# EAGLE design HybrideNixieClock (EAGLE 9.5.2)
COMPANY: ADAFRUIT INDUSTRIES; DRAWN: KTOWN; REV: B
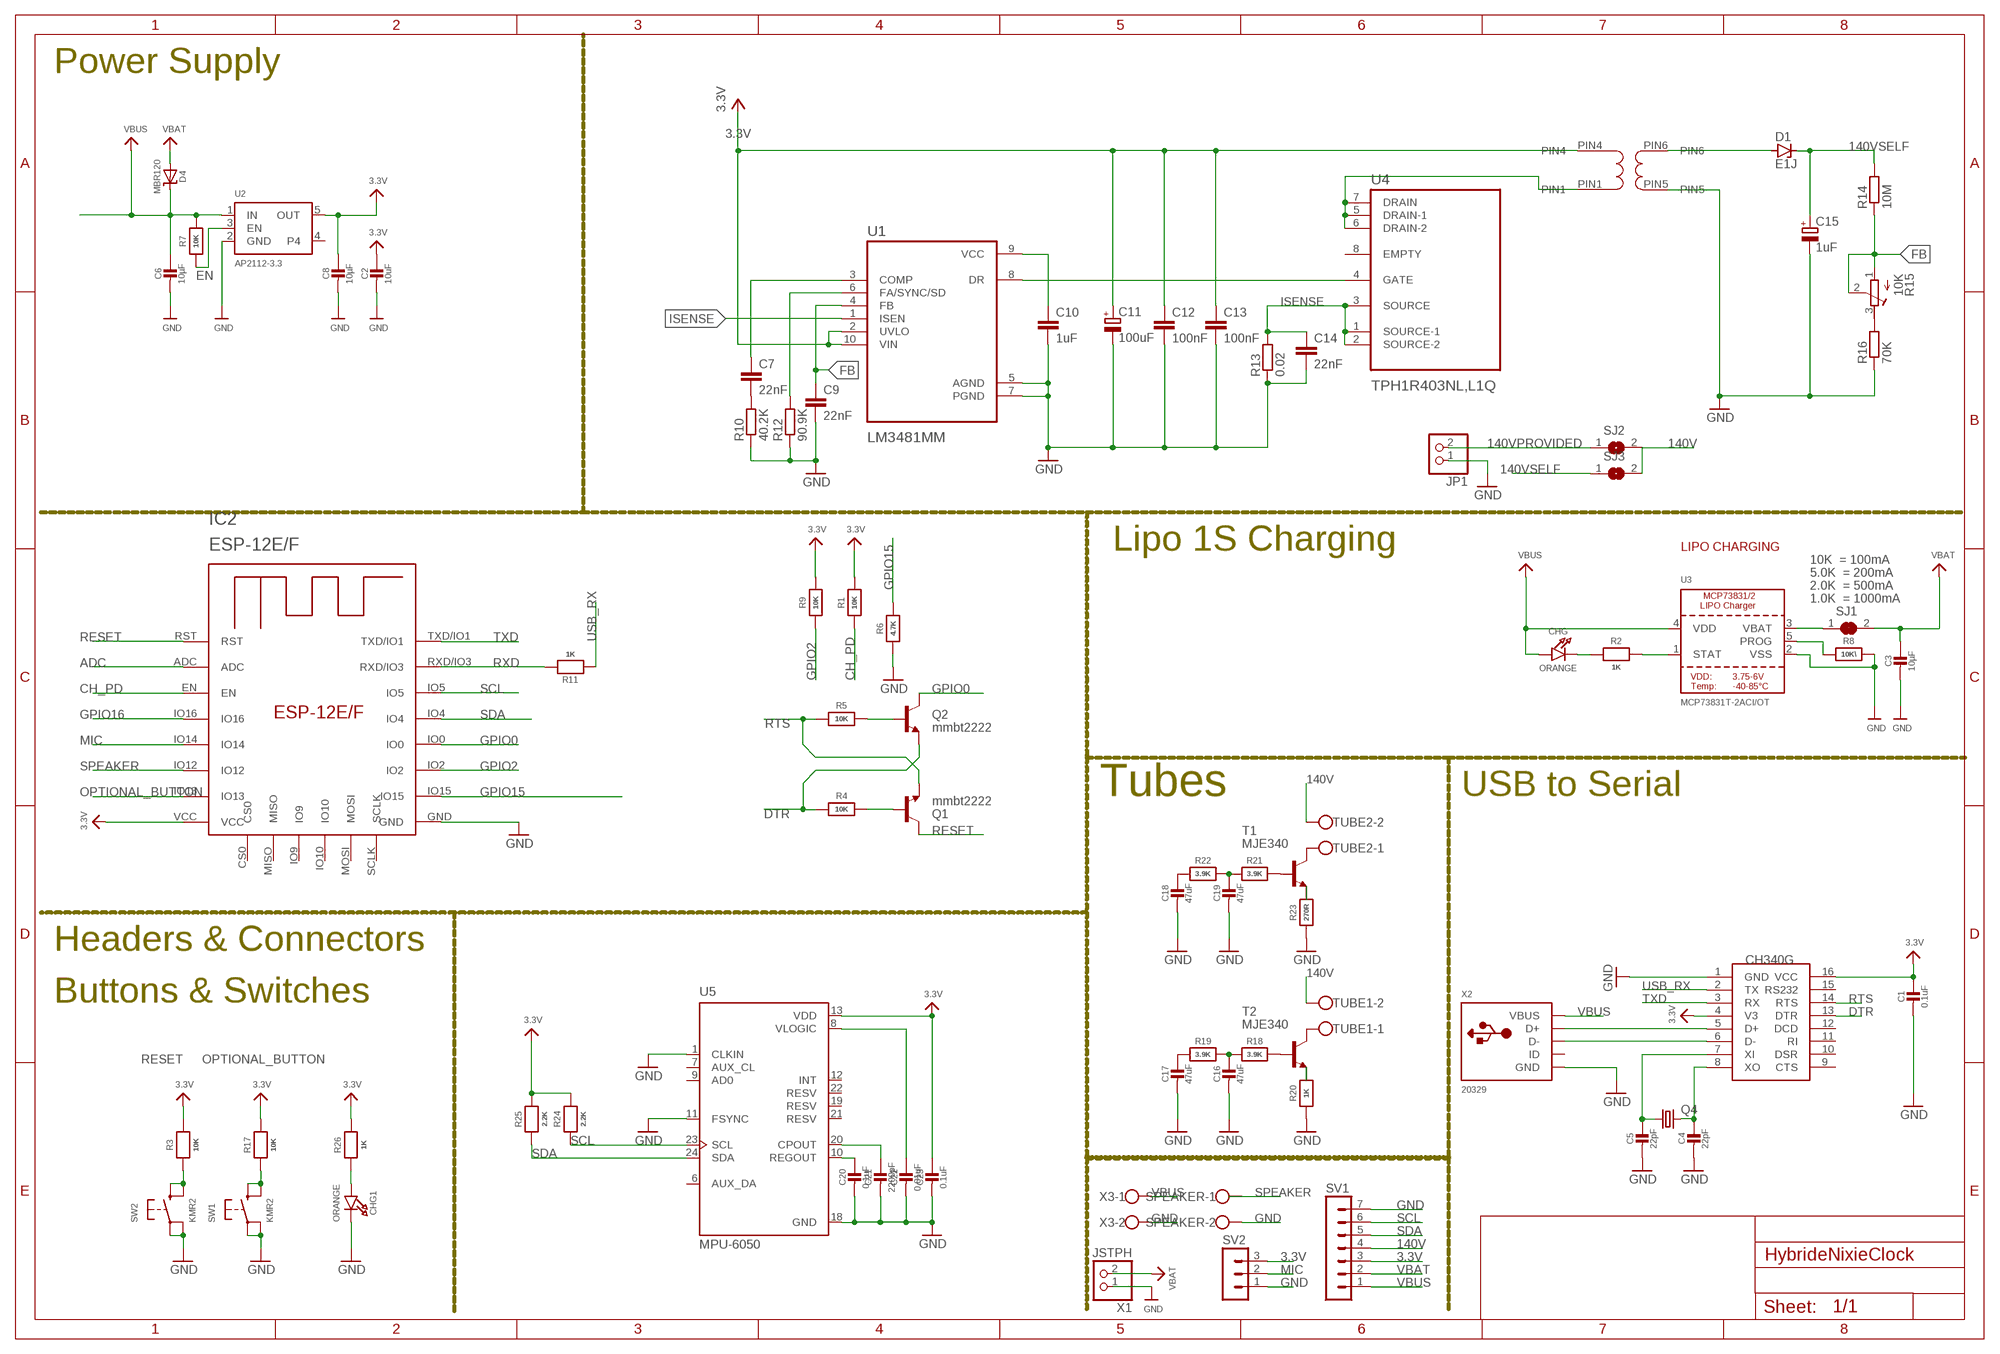
[diagram p0: schematic, sheet 1]

## Parts
C1  0.1uF  CAP_CERAMIC0603_NO  [0603-NO]
C2  10uF  CAP_CERAMIC0805-NOOUTLINE  [0805-NO]
C3  10µF  CAP_CERAMIC0805-NOOUTLINE  [0805-NO]
C4  22pF  CAP_CERAMIC0603_NO  [0603-NO]
C5  22pF  CAP_CERAMIC0603_NO  [0603-NO]
C6  10µF  CAP_CERAMIC0805-NOOUTLINE  [0805-NO]
C7  22nF  C-EUC0603  [C0603]
C8  10µF  CAP_CERAMIC0805-NOOUTLINE  [0805-NO]
C9  22nF  C-EUC0603  [C0603]
C10  1uF  C-EUC0603  [C0603]
C11  100uF  CPOL-EUCT3216  [CT3216]
C12  100nF  C-EUC0603  [C0603]
C13  100nF  C-EUC0603  [C0603]
C14  22nF  C-EUC0603  [C0603]
C15  1uF  CPOL-EUCT3216  [CT3216]
C16  47uF  CAP_CERAMIC0603_NO  [0603-NO]
C17  47uF  CAP_CERAMIC0603_NO  [0603-NO]
C18  47uF  CAP_CERAMIC0603_NO  [0603-NO]
C19  47uF  CAP_CERAMIC0603_NO  [0603-NO]
C20  0.1uF  CAP_CERAMIC0603_NO  [0603-NO]
C21  2200pF  CAP_CERAMIC0603_NO  [0603-NO]
C22  0.01uF  CAP_CERAMIC0603_NO  [0603-NO]
C23  0.1uF  CAP_CERAMIC0603_NO  [0603-NO]
CHG  ORANGE  LED0805_NOOUTLINE  [CHIPLED_0805_NOOUTLINE]
CHG1  ORANGE  LED0805_NOOUTLINE  [CHIPLED_0805_NOOUTLINE]
D1  E1J  ZENER-DIODESMB  [SMB]
D4  MBR120  DIODE-SCHOTTKYSOD-123  [SOD-123]
IC2  ESP-12E/F  [ESP-12E]
JP1  PINHD-1X2  [1X02]
Q1  mmbt2222  TRANSISTOR_NPNSOT23-3  [SOT23-3]
Q2  mmbt2222  TRANSISTOR_NPNSOT23-3  [SOT23-3]
Q4  CRYSTALCTS406  [CTS406]
R1  10K  RESISTOR_0603_NOOUT  [0603-NO]
R2  1K  RESISTOR_0603_NOOUT  [0603-NO]
R3  10K  RESISTOR_0603_NOOUT  [0603-NO]
R4  10K  RESISTOR_0603_NOOUT  [0603-NO]
R5  10K  RESISTOR_0603_NOOUT  [0603-NO]
R6  4.7K  RESISTOR_0603_NOOUT  [0603-NO]
R7  10K  RESISTOR_0603_NOOUT  [0603-NO]
R8  10K\  RESISTOR_0603_NOOUT  [0603-NO]
R9  10K  RESISTOR_0603_NOOUT  [0603-NO]
R10  40.2K  R-EU_R0603  [R0603]
R11  1K  RESISTOR_0603MP  [_0603MP]
R12  90.9K  R-EU_R0603  [R0603]
R13  0.02  R-EU_R0603  [R0603]
R14  10M  R-EU_R0603  [R0603]
R15  10K  R-TRIMM4G/J  [RTRIM4G/J]
R16  70K  R-EU_R0603  [R0603]
R17  10K  RESISTOR_0603_NOOUT  [0603-NO]
R18  3.9K  RESISTOR_0603_NOOUT  [0603-NO]
R19  3.9K  RESISTOR_0603_NOOUT  [0603-NO]
R20  1K  RESISTOR_0603_NOOUT  [0603-NO]
R21  3.9K  RESISTOR_0603_NOOUT  [0603-NO]
R22  3.9K  RESISTOR_0603_NOOUT  [0603-NO]
R23  270R  RESISTOR_0603_NOOUT  [0603-NO]
R24  2.2K  RESISTOR_0603_NOOUT  [0603-NO]
R25  2.2K  RESISTOR_0603_NOOUT  [0603-NO]
R26  1K  RESISTOR_0603_NOOUT  [0603-NO]
SJ1  SOLDERJUMPER_CLOSED  [SOLDERJUMPER_CLOSEDWIRE]
SJ2  SJ  [SJ]
SJ3  SJ  [SJ]
SPEAKER  W237-102  [W237-102]
SV1  MA07-1  [MA07-1]
SV2  MA03-1  [MA03-1]
SW1  KMR2  SWITCH_TACT_SMT4.6X2.8  [BTN_KMR2_4.6X2.8]
SW2  KMR2  SWITCH_TACT_SMT4.6X2.8  [BTN_KMR2_4.6X2.8]
T1  MJE340  [TO126]
T2  MJE340  [TO126]
TUBE1  W237-102  [W237-102]
TUBE2  W237-102  [W237-102]
U1  LM3481MM  [SOP50P490X110-10N]
U2  AP2112-3.3  VREG_SOT23-5  [SOT23-5]
U3  MCP73831T-2ACI/OT  MCP73831/2  [SOT23-5]
U4  TPH1R403NL,L1Q  [TRANS_TPHR8504PL,L1Q]
U5  MPU-6050  [QFN50P400X400X95-24N]
U$6  TTRN-060S-013  [TTRN-060S-013]
U$7  CH340G  [SOIC16]
X1  JSTPH  CON_JST_PH_2PIN  [JSTPH2]
X2  20329  USB_MICRO_20329_V2  [4UCONN_20329_V2]
X3  W237-102  [W237-102]

## Nets
3.3V: C1.1 C2.1 C8.1 C11.+ C12.1 C13.1 C23.1 IC2.VCC R1.2 R3.2 R9.2 R17.2 R24.2 R25.2 R26.2 SV1.3 SV2.3 U1.2(UVLO) U1.10(VIN) U2.5(OUT) U5.13(VDD) U$6.PIN4 U$7.4(V3) U$7.16(VCC)
140V: SJ2.2 SJ3.2 SV1.4 TUBE1.2 TUBE2.2
140VPROVIDED: JP1.2 SJ2.1
140VSELF: C15.+ D1.C R14.2 SJ3.1
ADC: IC2.ADC
CH_PD: IC2.EN R1.1
DTR: Q2.2(E) R4.1 U$7.13(DTR)
EN: R7.1 U2.3(EN)
FB: C9.1 R14.1 R15.1(A) R15.2(S) U1.4(FB)
GND: C1.2 C2.2 C3.2 C4.2 C5.2 C6.2 C8.2 C9.2 C10.2 C11.- C12.2 C13.2 C14.2 C15.- C16.2 C17.2 C18.2 C19.2 C20.2 C21.2 C22.2 C23.2 CHG1.C IC2.GND JP1.1 R6.1 R8.2 R10.1 R12.1 R13.1 R16.1 R20.1 R23.1 SPEAKER.2 SV1.7 SV2.1 SW1.A'(P1) SW1.A(P) SW2.A'(P1) SW2.A(P) U1.5(AGND) U1.7(PGND) U2.2(GND) U3.2(VSS) U5.1(CLKIN) U5.11(FSYNC) U5.18(GND) U$6.PIN5 U$7.1(GND) X1.1 X2.BASE@1(GND) X2.BASE@2(GND) X2.GND X2.SPRT@1(GND) X2.SPRT@2(GND) X2.SPRT@3(GND) X2.SPRT@4(GND) X3.2
GPIO0: IC2.IO0 Q2.3(C)
GPIO2: IC2.IO2 R9.1
GPIO15: IC2.IO15 R6.2
GPIO16: IC2.IO16
ISENSE: C14.1 R13.2 U1.1(ISEN) U4.1(SOURCE-1) U4.2(SOURCE-2) U4.3(SOURCE)
MIC: IC2.IO14 SV2.2
N$1: CHG.C R2.1
N$2: C7.2 R10.2
N$3: R2.2 U3.1(STAT)
N$4: R8.1 U3.5(PROG)
N$5: C7.1 U1.3(COMP)
N$6: U4.5(DRAIN-1) U4.6(DRAIN-2) U4.7(DRAIN) U$6.PIN1
N$7: SJ1.1 U3.3(VBAT)
N$8: R18.2 T2.3(B)
N$9: U$7.6(D-) X2.D-
N$10: U$7.5(D+) X2.D+
N$11: D1.A U1.8(DR) U4.4(GATE) U$6.PIN6
N$12: Q1.1(B) R4.2
N$13: Q2.1(B) R5.2
N$14: C5.1 Q4.1 U$7.7(XI)
N$15: C4.1 Q4.3 U$7.8(XO)
N$16: C10.1 U1.9(VCC)
N$17: R12.2 U1.6(FA/SYNC/SD)
N$18: R23.2 T1.1(E)
N$19: R15.3(E) R16.2
N$20: C16.1 R18.1 R19.2
N$21: C17.1 R19.1
N$22: R21.2 T1.3(B)
N$23: C19.1 R21.1 R22.2
N$24: C18.1 R22.1
N$25: T2.2(C) TUBE1.1
N$26: T1.2(C) TUBE2.1
N$27: R20.2 T2.1(E)
N$28: C20.1 U5.10(REGOUT)
N$29: C21.1 U5.20(CPOUT)
N$30: CHG1.A R26.1
N$31: C22.1 U5.8(VLOGIC)
OPTIONAL_BUTTON: IC2.IO13 R17.1 SW1.B'(S1) SW1.B(S)
RESET: IC2.RST Q1.3(C) R3.1 SW2.B'(S1) SW2.B(S)
RTS: Q1.2(E) R5.1 U$7.14(RTS)
RXD: IC2.RXD/IO3 R11.2
SCL: IC2.IO5 R24.1 SV1.6 U5.23(SCL)
SDA: IC2.IO4 R25.1 SV1.5 U5.24(SDA)
SPEAKER: IC2.IO12 SPEAKER.1
TXD: IC2.TXD/IO1 U$7.3(RX)
USB_RX: R11.1 U$7.2(TX)
VBAT: C3.1 D4.A SJ1.2 SV1.2 X1.2
VBUS: C6.1 CHG.A D4.C R7.2 SV1.1 U2.1(IN) U3.4(VDD) X2.VBUS X3.1
Unconnected: IC2.CS0 IC2.IO9 IC2.IO10 IC2.MISO IC2.MOSI IC2.SCLK U2.4 U4.8(EMPTY) U5.6(AUX_DA) U5.7(AUX_CL) U5.9(AD0) U5.12(INT) U5.19(RESV) U5.21(RESV) U5.22(RESV) U$7.9(CTS) U$7.10(DSR) U$7.11(RI) U$7.12(DCD) U$7.15(RS232) X2.ID

## Notes on the sheet
- Power Supply
- Lipo 1S Charging | LIPO CHARGING
- 10K  = 100mA
- 5.0K  = 200mA
- 2.0K  = 500mA
- 1.0K  = 1000mA
- Tubes | USB to Serial
- Headers & Connectors
- Buttons & Switches

## Library data of the parts
C1-C6 C8 C16-C23 = microbuilder:CAP_CERAMIC: Ceramic Capacitors For new designs, use the packages preceded by an '_' character since they are more reliable: The following footprints should be used on most boards: _0402 - Standard footprint for regular board layouts _0603 - Standard footprint for regular board layouts _0805 - Standard footprint for regular board layouts _1206 - Standard footprint for regular board layouts For extremely tight-pitch boards where space is at a premium, the following 'micro-pitch' footprints can be used (smaller pads, no silkscreen outline, etc.): _0402MP - Micro-pitch footprint for very dense/compact boards _0603MP - Micro-pitch footprint for very dense/compact boards _0805MP - Micro-pitch footprint for very dense/compact boards _1206MP - Micro-pitch footprint for very dense/compact boards
C7 C9 C10 C12-C14 = rcl:C-EU: CAPACITOR, European symbol; SPICEPREFIX: C
C11 C15 = rcl:CPOL-EU: POLARIZED CAPACITOR, European symbol; SPICEPREFIX: C
CHG CHG1 = microbuilder:LED: LED 0603 - 0603 Surface Mount Package 2mA: Green LED - Low Power (3.9mcd, 2ma, 1.7Vf) - Digikey: 475-2709-2-ND Orange LED - Low Power (9.8mcd, 2ma, 1.8Vf) - Digikey: 475-1194-2-ND Red LED - Low Power (5mcd, 2ma, 1.8Vf) - Digikey: 475-1195-2-ND Yellow LED - Low Power (7mcd, 2ma, 1.8Vf) - Digikey: 475-1196-2-ND 5mA: Blue LED - Low Power (17mcd, 5ma, 2.9Vf) - Digikey: LNJ937W8CRACT-ND 0805 - 0805 Surface Mount Package 2mA: Red LED (8.8mcd, 2mA, 1.8Vf, Clear) - Low Power [Digikey: 475-2510-1-ND] Green LED (5mcd, 2mA, 1.8Vf, Clear) - Low Power [Digikey: 475-2730-1-ND] Yellow LED (11.3mcd, 2mA, 1.8Vf, Clear) - Low Power [Digikey: 475-2555-1-ND] 20mA: Red LED (104mcd, 20mA, Diffused) - LS R976 [Digikey: 475-1278-6-ND] Red LED (12mcd, 20mA, 2.0Vf, Clear) - APT2012EC [Digikey: 754-1128-1-ND] Green LED (15mcd, 20mA, 2.2Vf, Clear) - APT2012GC [Digikey: 754-1131-1-ND] Orange LED (160mcd, 20mA, 2.1Vf, Clear) - APT2012SECK [Digikey: 754-1130-1-ND] 1206 - 1206 Surface Mount Package Green LED (26mcd, 20mA, Diffused) - LG N971 [Digikey: 475-1407-6-ND] Red LED (15mcd, 20mA, Diffused) - LH N974 [Digikey: 475-1416-6-ND] Cree - Cree High-Power Surface Mount LEDs XPEBWT-L1-0000-00D50 - White 111lm 350mA 2.9Vf 6200K 110° XTEAWT-00-0000-00000LEE3 - White 114lm 350mA 2.85Vf 5000K 115° Everlight - Everlight 45-21 Series Surface Mount LEDs 45-21/QK2C-B2832AC2CB2/2T - Warm White 2000mcd 20mA 3.25Vf 3050K 120° 45-21/LK2C-B38452C4CB2/2T - Nuetral White 2000mcd 20mA 3.25Vf 4150K 120° 45-21/LK2C-B50634C6CB2/2T - Cold White 2200mcd 20mA 3.25Vf 5650K 120° PLCC2 Reverse Mount LS T77K-J1L2-1-0-2-R18-Z - Red 11.25mcd 2mA 1.8Vf 630nm 120° LO T77K-L1M2-24-Z - Orange 19.6mcd 2mA 1.8Vf 606nm 120° LY T77K-K2M1-26-Z - Yellow 15.7mcd 2mA 1.8Vf 587nm 120°
D1 = diode:ZENER-DIODE: Z-Diode
D4 = microbuilder:DIODE-SCHOTTKY
IC2 = esp-12e-f:ESP-12E/F
JP1 = pinhead:PINHD-1X2: PIN HEADER
Q1 Q2 = SparkFun:TRANSISTOR_NPN: Transistor NPN BJT configuration in SOT23 package. MMBT2222 is the common NPN we use. Double check BCE configuration again layout.
Q4 = crystal:CRYSTAL: CRYSTAL; OC_FARNELL: unknown; OC_NEWARK: unknown
R1-R9 R11 R17-R26 = microbuilder:RESISTOR: Resistors For new designs, use the packages preceded by an '_' character since they are more reliable: The following footprints should be used on most boards: _0402 - Standard footprint for regular board layouts _0603 - Standard footprint for regular board layouts _0805 - Standard footprint for regular board layouts _1206 - Standard footprint for regular board layouts For extremely tight-pitch boards where space is at a premium, the following 'micro-pitch' footprints can be used (smaller pads, no silkscreen outline, etc.): _0402MP - Micro-pitch footprint for very dense/compact boards _0603MP - Micro-pitch footprint for very dense/compact boards _0805MP - Micro-pitch footprint for very dense/compact boards _1206MP - Micro-pitch footprint for very dense/compact boards
R10 R12-R14 R16 = rcl:R-EU_: RESISTOR, European symbol; SPICEPREFIX: R
R15 = rcl:R-TRIMM: Trimm resistor; SPICEMODEL: X; SPICEPREFIXL: POT
SJ1 = microbuilder:SOLDERJUMPER_CLOSED: Solder Jumper - Closed These solder jumpers are closed by default CLOSEDWIRE - 10 mil trace between pads that can be cut and resoldered later CLOSEDPERM - 63 mil trace between pads for a permanent connection (used to 'bridge' two signals, a shameless hack for Eagle). Can double as a test point as well (no cream layer)
SJ2 SJ3 = jumper:SJ: SMD solder JUMPER
SPEAKER TUBE1 TUBE2 X3 = con-wago-500:W237-102: WAGO SCREW CLAMP; MPN: 237-102; OC_FARNELL: unknown; OC_NEWARK: 70K9898
SV1 = con-lstb:MA07-1: PIN HEADER; OC_FARNELL: unknown; OC_NEWARK: unknown
SV2 = con-lstb:MA03-1: PIN HEADER; OC_FARNELL: unknown; OC_NEWARK: unknown
SW1 SW2 = microbuilder:SWITCH_TACT_SMT: SMT Tact Switches 6x6mm - Digikey: P12940SCT-ND KMR2 (4.6x2.8mm) - Digikey: 401-1426-1-ND EVQ-PQHB55 - Light Touch, 160GF (4.5x4.5mm) - Digikey: P8090SCT-ND KMT0 - KMT021 NGJ LHS (etc.) IP68/Waterproof - Digikey: CKN10289CT-ND
T1 T2 = MJE340:MJE340: NPN TRANSISTOR Check prices <https://pricing.snapeda.com/search/part/MJE340/?ref=eda>; AVAILABILITY: Good; DESCRIPTION: Bipolar (BJT) Transistor NPN 300V 500mA 20.8W Through Hole SOT-32-3; MF: STMicroelectronics; MP: MJE340; PACKAGE: TO-126-3 Motorola; PRICE: None; PURCHASE-URL: https://pricing.snapeda.com/search/part/MJE340/?ref=eda
U1 = LM3481MM:LM3481MM: Check prices <https://snapeda.com/parts/LM3481MM/NOPB/Texas%20Instruments/view-part/?ref=eda>; ARROW_ASIA-PURCHASE-URL: https://snapeda.com/shop?store=Arrow+Asia&id=15397; ARROW_ELECTRONICS-PURCHASE-URL: https://snapeda.com/shop?store=Arrow+Electronics&id=15397; AVAILABILITY: Good; DESCRIPTION: 2.97V to 48V High-Efficiency Controller for Boost, SEPIC and Flyback 10-VSSOP -40 to 125; DIGIKEY-PURCHASE-URL: https://snapeda.com/shop?store=DigiKey&id=15397; MF: Texas Instruments; MOUSER-PURCHASE-URL: https://snapeda.com/shop?store=Mouser&id=15397; MP: LM3481MM/NOPB; PACKAGE: VSSOP-10 Texas Instruments; PRICE: None; TEXAS_INSTRUMENTS-PURCHASE-URL: https://snapeda.com/shop?store=Texas+Instruments&id=15397
U2 = microbuilder:VREG_SOT23-5: SOT23-5 Fixed Voltage Regulators Part Current Out V Out V In V Dropout θJA (°C/W) TJ (°C) Digikey Part No. ADP121 150mA 3.3V 3.4-5.5V 0.09V @ 150mA -- -- ADP121-AUJZ33R7CT-ND ADP121 150mA 3.0V 3.1-5.5V 0.09V @ 150mA -- -- ADP121-AUJZ30R7CT-ND ADP122 300mA 3.3V 3.4-5.5V 0.085V @ 300mA -- -- ADP122AUJZ-3.3-R7CT-ND ADP1712 300mA 3.3V 3.5-5.5V 0.17V @ 300mA -- -- ADP1712AUJZ-3.3-R7TR-ND AP7311 (Low Cost) 150mA 3.3V 3.5-6V 0.15V @ 150mA -- -- AP7311-33WG-7DICT-ND LD39015M18R 150mA 1.8V 1.9V-5.5V 0.08V @ 100mA -- -- 497-6977-1-ND LP2985A-33DBVR 150mA 3.3V 3.3-16V 0.28V @ 150mA 206 150 296-18479-1-ND MCP1824T-3302E/OT 300mA 3.3V 3.5V-6V 0.2V @ 300mA -- -- MCP1824T-3302E/OTCT-ND MIC5205-2.5YM5 TR 150mA 2.5V 2.7-16V 0.165V @ 150mA -- -- 576-1257-2-ND MIC5205-3.0YM5 TR 150mA 3.0V 3.2V-16V 0.165V @ 150mA -- -- 576-1258-2-ND MIC5205-3.3YM5 TR 150mA 3.3V 3.5V-16V 0.165V @ 150mA -- -- 576-1259-2-ND TPS780330220 150mA 3.3V+2.2V 3.6-5.5V 250mV Max -- -- 296-23332-1-ND TDA3663/N1,135 100mA 3.3V 3.5-45V 0.18V @ 50mA -- -- 568-5343-1-ND Max operating temp can be calculated using θJA, TJ (max junction temperature), and power in watts. Set the "Maximum Ambient Temperature" until it reaches TJ ("Max Junction Temperature"), which is the absolute limit for safe use of the regulator: Heat Sink Temperature Calculator <http://www.daycounter.com/Calculators/Heat-Sink-Temperature-Calculator.phtml> For example, With 12V source into a 3.3V LP2985 and a 30mA load, we are dissipating (12V-3.3V) * 0.03A = 0.261W. With a θJA of 206 °C/W, a TJ of 150°C, and 261mW we can safely use the chip without a heat sink up to 75°C (=147.1°C Junction Temperature).
U3 = microbuilder:MCP73831/2: MCP73831/2 LIPO Charger VDD: 3.75 - 6V Temp -40 - 85°C Programmable Charge Rate: 15-500mA NOTE: STAT is a tri-state logic output on the MCP73831 and an open-drain output on the MCP73832. SOT23-5 with 4.2V output and tri-state logic on STAT = MCP73831T-2ACI/OT
U4 = TPH1R403NL_L1Q:TPH1R403NL,L1Q: None Check prices <https://snapeda.com/parts/TPH1R403NL%2CL1Q/Toshiba%20Semiconductor/view-part/?ref=eda>; AVAILABILITY: Warning; DESCRIPTION: N-Channel 30V 60A (Ta) 1.6W (Ta), 64W (Tc) Surface Mount 8-SOP Advance (5x5); MF: Toshiba Semiconductor; MOUSER-PURCHASE-URL: https://snapeda.com/shop?store=Mouser&id=739373; MP: TPH1R403NL,L1Q; PACKAGE: SOP-8 Toshiba; PRICE: None
U5 = MPU-6050:MPU-6050: MPU-6050 Six-Axis (Gyro + Accelerometer) MEMS MotionTracking™ Devices Check prices <https://pricing.snapeda.com/search/part/MPU-6050/?ref=eda>; AVAILABILITY: Warning; DESCRIPTION: Accelerometer, Gyroscope, 6 Axis Sensor I²C Output; MF: TDK InvenSense; MP: MPU-6050; PACKAGE: VFQFN-24 TDK InvenSense; PRICE: None; PURCHASE-URL: https://pricing.snapeda.com/search/part/MPU-6050/?ref=eda
U$6 = Nixie Coil V2:TTRN-060S-013
U$7 = ch340g:CH340G
X1 = microbuilder:CON_JST_PH_2PIN: JST 2-Pin Right-Angle Connector PH-Series - 4UConnector: 17311 SH-Series - 4UConnector: 07278
X2 = microbuilder:USB: USB Connectors USBMINIB - Surface Mount Female Mini-B USB Connector 4UConnector: 06564

## Board
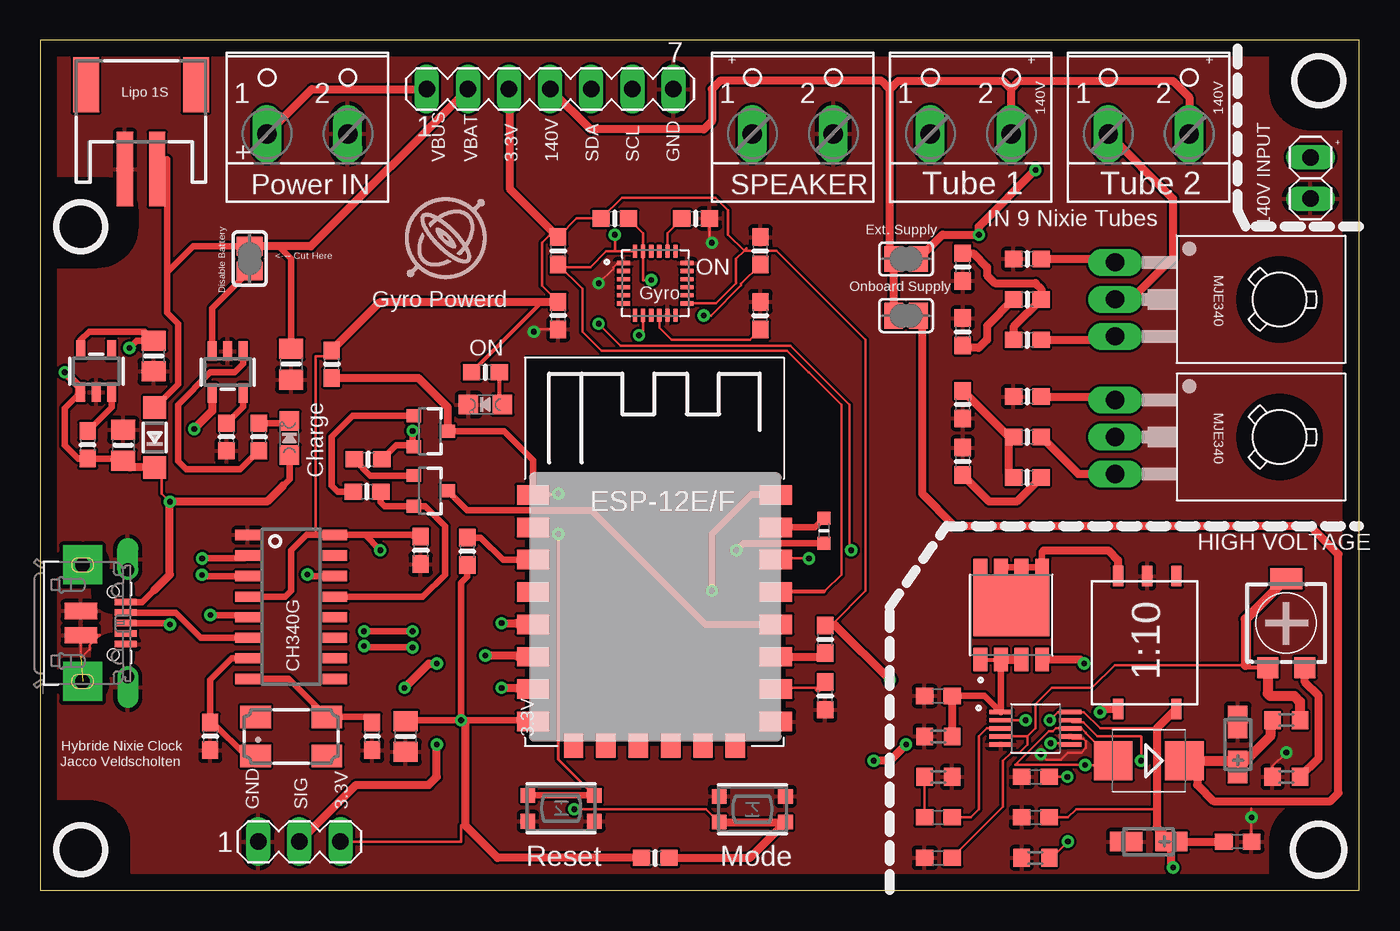
[diagram p1: board, top side]
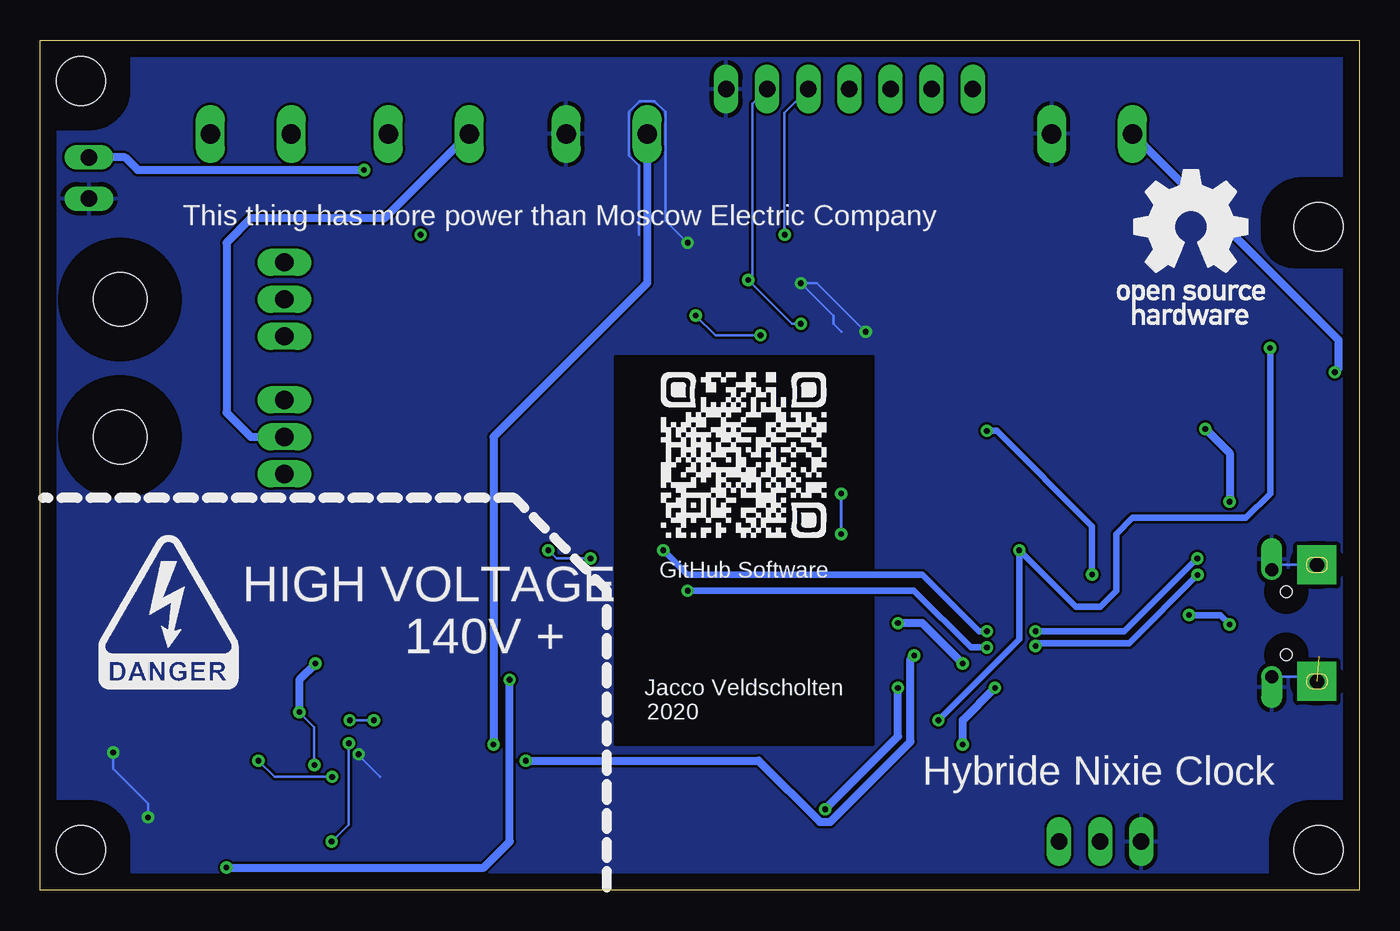
[diagram p2: board, bottom side, seen from below]

Size 81.5 x 52.5 mm. Coordinates in mm from the lower left corner, seen from the top.
Outline: 0,0 81.5,0 81.5,52.5 0,52.5 0,0
Copper layers (1*16): Top 0.035mm / dielectric 1.5mm / Bottom 0.035mm
Design rules "default *": minimum track width 6mil, minimum drill 0.35mm, track to track 6mil, track to pad 6mil, pad to pad 6mil, via to via 6mil, smd to smd 6mil, copper to edge 40mil, drill to drill 6mil, minimum pad ring 10mil, minimum via ring 8mil, stop-mask expansion 4mil, vias tented up to drill 20mil, thermal gap 10mil
Holes 3 mm at 2.5,2.5 79,50 79,2.5 2.5,41
tRestrict: area 30,9 to 46,33; area 0,0 to 5.5,5.5; area 76,0 to 81.5,5.5; area 0,38.5 to 6,44; area 76,47 to 81.5,52.5
bRestrict: area 30,9 to 46,33; area 76,0 to 81.5,5.5; area 76,47 to 81.5,52.5; area 0,0 to 5.5,5.5; area 0,38.5 to 6,44

### Footprints (pad centres in the part's own frame; a part is rotated, then mirrored left to right if it is on the bottom)
0603-NO = smd 1.075 x 1: 1 -0.85,0; 2 0.85,0
0805-NO = smd 1.24 x 1.5: 1 -0.95,0; 2 0.95,0
C0603 = smd 1.1 x 1: 1 -0.85,0; 2 0.85,0
CT3216 = smd 2 x 1.2: + -1.4,0; - 1.4,0
CHIPLED_0805_NOOUTLINE = smd 1.2 x 1.2: A 0,-1.05; C 0,1.05
SMB = smd 2.4 x 2.4: A 2.2,0; C -2.2,0
SOD-123 = smd 1.4 x 1.4: A 1.85,0; C -1.85,0
ESP-12E = smd 2 x 1.2: ADC -7.46,5.53; EN -7.46,3.53; GND 7.54,-6.47; IO0 7.54,-0.47; IO2 7.54,-2.47; IO4 7.54,1.53; IO5 7.54,3.53; IO12 -7.46,-2.47; IO13 -7.46,-4.47; IO14 -7.46,-0.47; IO15 7.54,-4.47; IO16 -7.46,1.53; RST -7.46,7.53; RXD/IO3 7.54,5.53; TXD/IO1 7.54,7.53; VCC -7.46,-6.47 | smd 1.2 x 1.5: CS0 -4.96,-7.97; IO9 -0.96,-7.97; IO10 1.04,-7.97; MISO -2.96,-7.97; MOSI 3.04,-7.97; SCLK 5.04,-7.97
1X02 = drill 1.016 long: 1 -1.27,0; 2 1.27,0
SOT23-3 = smd 0.8 x 0.9: 1 -0.95,-1; 2 0.95,-1; 3 0,1.1
CTS406 = smd 1.9 x 1.4: 1 -2.2,-1.2; 2 2.2,-1.2; 3 2.2,1.2; 4 -2.2,1.2
R0603 = smd 1 x 1.1: 1 -0.85,0; 2 0.85,0
_0603MP = smd 0.8 x 0.8: 1 -0.762,0; 2 0.762,0
RTRIM4G/J = smd 1.3 x 1.3: 1 -1.15,-2.75; 3 1.15,-2.75 | smd 2 x 1.3: 2 0,2.75
SOLDERJUMPER_CLOSEDWIRE = smd 1.168 x 1.6: 1 -0.762,0; 2 0.762,0 | smd 0.635 x 0.203: WIRE 0,0
SJ = smd 1.168 x 1.6: 1 -0.762,0; 2 0.762,0
W237-102 = drill 1.194 long: 1 -2.5,-1.27; 2 2.5,-1.27
MA07-1 = drill 1.016 long: 1 -7.62,0; 2 -5.08,0; 3 -2.54,0; 4 0,0; 5 2.54,0; 6 5.08,0; 7 7.62,0
MA03-1 = drill 1.016 long: 1 -2.54,0; 2 0,0; 3 2.54,0
BTN_KMR2_4.6X2.8 = smd 0.9 x 0.9: A 2.05,0.8; A' -2.05,0.8; B 2.05,-0.8; B' -2.05,-0.8
TO126 = drill 1.118 long: 1 -2.286,-5.08; 2 0,-5.08; 3 2.286,-5.08 | hole 3.302: 0,5.08
SOP50P490X110-10N = smd 1.47 x 0.28: 1 -2.15,1; 2 -2.15,0.5; 3 -2.15,0; 4 -2.15,-0.5; 5 -2.15,-1; 6 2.15,-1; 7 2.15,-0.5; 8 2.15,0; 9 2.15,0.5; 10 2.15,1
SOT23-5 = smd 0.55 x 1.2: 1 -0.95,-1.3; 2 0,-1.3; 3 0.95,-1.3; 4 0.95,1.3; 5 -0.95,1.3
TRANS_TPHR8504PL,L1Q = smd 1.45 x 0.85: 1 -2.75,1.905; 2 -2.75,0.635; 3 -2.75,-0.635; 4 -2.75,-1.905 | smd 1.05 x 0.85: 5 2.95,-1.905; 6 2.95,-0.635; 7 2.95,0.635; 8 2.95,1.905 | smd 3.75 x 4.7: 9 0.55,0
QFN50P400X400X95-24N = smd 0.79 x 0.26: 1 -1.97,1.25; 2 -1.97,0.75; 3 -1.97,0.25; 4 -1.97,-0.25; 5 -1.97,-0.75; 6 -1.97,-1.25; 13 1.97,-1.25; 14 1.97,-0.75; 15 1.97,-0.25; 16 1.97,0.25; 17 1.97,0.75; 18 1.97,1.25 | smd 0.26 x 0.79: 7 -1.25,-1.97; 8 -0.75,-1.97; 9 -0.25,-1.97; 10 0.25,-1.97; 11 0.75,-1.97; 12 1.25,-1.97; 19 1.25,1.97; 20 0.75,1.97; 21 0.25,1.97; 22 -0.25,1.97; 23 -0.75,1.97; 24 -1.25,1.97
TTRN-060S-013 = smd 1.27 x 0.635: PIN1 7.9,-1.6; PIN3 7.9,-5.2; PIN4 -0.3,-5.2; PIN5 7.9,-3.4; PIN6 -0.3,-1.6
SOIC16 = smd 0.635 x 1.524: 1 -4.445,-2.695; 2 -3.175,-2.695; 3 -1.905,-2.695; 4 -0.635,-2.695; 5 0.635,-2.695; 6 1.905,-2.695; 7 3.175,-2.695; 8 4.445,-2.695; 9 4.445,2.695; 10 3.175,2.695; 11 1.905,2.695; 12 0.635,2.695; 13 -0.635,2.695; 14 -1.905,2.695; 15 -3.175,2.695; 16 -4.445,2.695
JSTPH2 = smd 1 x 4.6: 1 -1,-3.7; 2 1,-3.7 | smd 1.6 x 3.4: NC1 -3.4,1.5; NC2 3.4,1.5
4UCONN_20329_V2 = smd 1 x 2: BASE@1 -0.75,-2; BASE@2 0.75,-2 | smd 0.4 x 1.35: D+ 0,0.775; D- -0.65,0.775; GND 1.3,0.775; ID 0.65,0.775; VBUS -1.3,0.775 | drill 0.8 pad 1.143 offset: SPRT@1 -3.3,0.9; SPRT@2 3.3,0.9 | drill 0.9 pad 2.413 square: SPRT@3 -3.6,-1.9; SPRT@4 3.6,-1.9 | hole 0.7: -1.95,0; 1.95,0

### Placement (x,y rotation side)
C1  23.5,21 270 top
C2  22.57,9.49 270 top
C3  15.5,32.5 270 top
C4  20.5,9.5 270 top
C5  10.5,9.5 270 top
C6  5.12,27.49 90 top
C7  55.5,4.5 180 top
C8  7,33 270 top
C9  55.5,2 180 top
C10  61.5,7 180 top
C11  68.5,3 180 top
C12  61.5,4.5 180 top
C13  74,3 0 top
C14  55.5,12 180 top
C15  74,9 90 top
C16  57,30 270 top
C17  57,26.5 90 top
C18  57,34.5 90 top
C19  57,38.5 270 top
C20  44.5,35.5 90 top
C21  40.5,41.5 0 top
C22  44.5,39.5 90 top
C23  32,35.5 270 top
CHG  15.39,27.94 0 top
CHG1  27.5,30 90 top
D1  68.5,8 180 top
D4  7.06,27.97 90 top
IC2  37.91,16.89 0 top
JP1  78.5,44 90 top
Q1  24.07,28.36 270 top
Q2  24.07,24.67 270 top
Q4  15.5,9.5 0 top
R1  26.38,20.94 270 top
R2  13.5,28 270 top
R3  18,32.5 90 top
R4  20.18,24.62 180 top
R5  20.26,26.62 180 top
R6  48.5,12 90 top
R7  2.92,27.51 270 top
R8  11.5,28 270 top
R9  48.5,15.5 90 top
R10  55.5,7 180 top
R11  48.43,22.21 90 top
R12  61.5,2 0 top
R13  55.5,9.5 0 top
R14  77,10.5 180 top
R15  77,16.5 0 top
R16  77,7 0 top
R17  38,2 180 top
R18  61,28 0 top
R19  61,25.5 180 top
R20  61,30.5 0 top
R21  61,34 0 top
R22  61,36.5 0 top
R23  61,39 0 top
R24  35.5,41.5 180 top
R25  32,39.5 90 top
R26  27.5,32 180 top
SJ1  12.93,39.02 90 top
SJ2  53.5,39 180 top
SJ3  53.5,35.5 180 top
SPEAKER  46.5,48 0 top
SV1  31.5,49.5 0 top
SV2  16,3 0 top
SW1  44,5 0 top
SW2  32.18,5.06 180 top
T1  71.5,36.5 270 top
T2  71.5,28 270 top
TUBE1  57.5,48 0 top
TUBE2  68.5,48 0 top
U1  61.5,10 0 top
U2  3.45,32.07 0 top
U3  11.57,32.01 180 top
U4  60,17 90 top
U5  38,37.5 0 top
U$6  65,11.5 90 top
U$7  15.5,17.5 270 top
X1  6.22,48.25 0 top
X2  4.5,16.5 270 top
X3  16.5,48 0 top

### Tracks (layer width: path | path; a pad name or v marks a point on that pad's centre or on a via)
3.3V  (via drill 0.35)
  Top 0.152: 69,10 65.5,10 64.5,11 U1.10 62.88,11 v62.38,10.5 | U1.2 v60.89,10.5 | C12.1 63.5,4.5 64.02,5.02 69,5.02 | U5.13 41.75,36.25 43,37.5 43,39 43.5,39.5 | 43.5,39.5 43.65,39.65 | R24.2 33.15,41.5 32.08,40.42 | 32.08,40.42 R25.2 | C23.1 31,37.35 31,40 31.43,40.42 32.08,40.42 | 43.5,39.5 42.5,40.5 42.5,42 41.72,42.78 35.93,42.78 R24.2 | R24.2 34.59,41.56 | 17,21.95 17,33 18,33 R3.2 | 29,49.5 SV1.3 | SV2.3 26,3 26,4 26.25,4 | 43.5,39.5 45.5,39.5 51,34 51,18.5 49,16.5 49.15,16.35
  Top 0.254: R26.2 31,36.35 C23.1
  Top 0.406: U$7.16 23,21.95 23.09,21.85 C1.1 | U$7.16 17,21.95 16.45,21.95 15.5,21 15.5,18.5 15.13,18.13 U$7.4 | U$7.16 20.05,21.95 v21,21 | v26,10.5 30.37,10.5 IC2.VCC | U2.5 2.5,34 3,34.5 6.45,34.5 C8.1 5.95,33.95 v5.5,33.5 | v26,10.5 22.63,10.5 C2.1 | R1.2 26.38,19.38 26,19 v26,10.5
  Top 0.508: U$6.PIN4 69,10 69,5.02 69,3.9 C11.+ | C11.+ C13.1 | v70,1.39 69.9,1.49 C11.+ | v26,10.5 26.25,10.25 26.25,4 28.25,2 R17.2 | R9.2 49.15,16.35 v52.5,13 | R3.2 21,36.35 C23.1 | R25.2 29,43.35 29,49.5
  Bottom 0.152: v60.89,10.5 v62.38,10.5
  Bottom 0.406: v26,10.5 21,15.5 v21,21 17.5,17.5 16,17.5 15,18.5 15,22 14,23 7,23 5.5,24.5 v5.5,33.5
  Bottom 0.508: v70,1.39 54.11,1.39 52.5,3 v52.5,13
140V
  Top 0.508: SJ3.2 SJ2.2 52.5,39.24 52.5,49.5 | 52.5,49.5 53,50 59.5,50 60,49.5 | TUBE1.2 60,49.5 | 60,49.5 60.5,50 70,50 71,49 TUBE2.2 | 52.5,49.5 52,50 42,50 41.5,49.5 41.5,47.5 41,47 34,47 SV1.4
140VPROVIDED  (via drill 0.35)
  Top 0.508: SJ2.1 55.76,40.5 v58,40.5 58,41 v61.5,44.5
  Bottom 0.508: v61.5,44.5 75.5,44.5 76.27,45.27 JP1.2
140VSELF
  Top 0.508: 71,7.7 D1.C 71.5,7.2 71.5,6.5 72.5,5.5 79.73,5.5 80.23,6 80.23,20.77 78.5,22.5 56.5,22.5 54.5,24.5 54.5,35.26 SJ3.1
  Top 0.61: R14.2 76,10.35 76,9.5 74.1,7.6 | 74.1,7.6 C15.+ | D1.C 73.7,8 74.1,7.6
CH_PD
  Top 0.406: R1.1 27.21,21.79 28.58,20.42 IC2.EN
DTR
  Top 0.406: R4.1 21.03,23.97 21.28,23.72 Q2.2 23.78,23.72 25,22.5 25,19.5 23.64,18.13 U$7.13
EN
  Top 0.406: R7.1 4.4,29.84 U2.3
FB
  Top 0.152: C9.1 59.5,5.15 59.5,8 60,8.5 60.5,8.5 61,9 61,9.5 | U1.4 61,9.5 | 61,9.5 61.5,10 61.5,11.5 62.5,12.5 65,12.5 66.4,13.9 74.5,13.9
  Top 0.254: R15.1 74.65,13.75 74.5,13.9
  Top 0.61: R15.2 74.5,16.75 74.5,13.9 | R15.1 75.85,12.15 76,12 77.5,12 77.85,11.65 R14.1
GND  (via drill 0.35)  (1 unrouted)
  Top 0.152: U1.7 63.78,9.37 64.46,9.37 64.61,9.21 64.61,8.79 64.33,8.5 63.5,8.5 63.05,8.05 62.18,8.05 v61.84,8.4 | 2.6,14.44 3.06,14.9 3.06,15.15 3.66,15.75 X2.BASE@2 2.5,14.54 2.6,14.44 | 2.5,14.44 2.6,14.44 | C21.2 41.35,40.15 v41.5,40 | 74.85,5.02 v74.85,4.5 C13.2 | R16.1 76.15,7.65 v77,8.5 | v34.5,37.5 35.41,38.41 35.41,38.47 35.68,38.75 U5.1 | v30.5,34.5 30.65,34.65 C23.2
  Bottom 0.152: v61.84,8.4 61.84,8.34 60.5,7 | X2.SPRT@4 2.9,13.2 X2.SPRT@2 | X2.SPRT@3 5.1,20.1 X2.SPRT@1 | v41.5,40 42.88,41.38 42.88,48.09 43.53,48.75 44.47,48.75 45.12,48.09 45.12,45.37 44.5,44.75 44.5,40.5 | v74.85,4.5 74.85,5.35 77,7.5 v77,8.5 | 32,34.5 32.5,35 32.5,35.5 v34.5,37.5 33.5,37.5 v30.5,34.5
  pour Top: 0,0 81.5,0 81.5,52.5 0,52.5
  pour Bottom: 0,0 81.5,0 81.5,52.5 0,52.5
GPIO0
  Top 0.406: Q2.3 26.38,23.46 34.04,23.46 41.08,16.42 IC2.IO0
GPIO2
  Top 0.508: IC2.IO2 48.27,14.42 R9.1
GPIO15
  Top 0.152: 48.08,12.42 48,12.5 45.5,12.5 IC2.IO15
  Top 0.406: 48.07,12.42 48.08,12.42 R6.2
ISENSE
  Top 0.254: U4.1 U4.2
  Top 0.406: C14.1 58.35,12 U1.1 59.35,14.23 U4.2
  Top 0.508: C14.1 R13.2 | U4.2 U4.3
MIC  (via drill 0.35)
  Top 0.152: 29.41,16.5 30.25,16.5 IC2.IO14
  Top 0.508: SV2.2 19.5,6.5 24,6.5 24.5,7 v24.5,9 | v22.5,12.5 24,14 v24.5,14 | v28.5,16.5 29.41,16.5 29.49,16.42
  Bottom 0.508: v24.5,9 24.5,10.5 v22.5,12.5 | v24.5,14 27,16.5 v28.5,16.5
N$1
  Top 0.406: R2.1 15.25,28.85 CHG.C
N$2
  Top 0.152: R10.2 C7.2
N$3
  Top 0.406: R2.2 12.35,26 9,26 8.5,26.5 8.5,30 10.5,32 12,32 12.52,32.52 U3.1
N$4
  Top 0.406: R8.1 12.52,29.87 U3.5
N$5
  Top 0.152: U1.3 58.5,10 58,9.5 58,5 57.5,4.5 C7.1
N$6
  Top 0.406: U4.7 U4.6 U4.5 61.91,20.91 62,21
  Top 0.508: U$6.PIN1 66.6,20.4 66,21 62,21
N$7
  Top 0.406: SJ1.1 10.62,35.95 U3.3
N$8
  Top 0.508: R18.2 64.14,25.71 T2.3
N$9
  Top 0.406: X2.D- 8.35,17.15 9.9,15.59 U$7.6
N$10  (via drill 0.35)
  Top 0.406: X2.D+ 7.92,16.5 v8,16.42 | v10.5,17 12.67,17 U$7.5
  Bottom 0.406: v8,16.42 8.58,17 v10.5,17
N$11  (via drill 0.35)
  Top 0.152: 64.33,10 64.61,9.71 64.61,9.69 D1.A 66.03,7.73 v64.57,7.73 64.5,7.75 60.25,7.75 62.32,9.82 62.57,9.82 62.75,10 U1.8
  Top 0.508: v64.5,14 64.25,14.25 U4.4 | v65.5,11 65.7,11.2 U$6.PIN6
  Bottom 0.152: v64.57,7.73 64.57,10.07 v65.5,11
  Bottom 0.508: v64.5,14 65.5,13 v65.5,11
N$12
  Top 0.406: Q1.1 19.31,29.31 18,28 18,25 18.38,24.62 R4.2
N$13
  Top 0.406: R5.2 19.41,26.59 20.38,25.62 Q2.1
N$14
  Top 0.406: U$7.7 11.82,14.33 10.5,13 C5.1 10.65,10.35 12.7,8.3 Q4.1
N$15
  Top 0.406: C4.1 20.15,10.7 Q4.3 15.35,13.05 U$7.8
N$16  (via drill 0.35)
  Top 0.152: U1.9 63.78,10.37 64.46,10.37 65.33,9.5 68,9.5 68.03,9.47 v68.03,8 | v63.48,7 C10.1
  Bottom 0.152: v68.03,8 67.03,7 v63.48,7
N$17  (via drill 0.35)
  Top 0.152: v63.5,3 62.5,2 R12.2 | U1.6 63.57,9.08 v62.44,9.08
  Bottom 0.152: v63.5,3 62.44,4.06 v62.44,9.08
N$18
  Top 0.508: R23.2 66.21,39 T1.1
N$19
  Top 0.508: R16.2 79,8.15 79,12 78.15,12.85 R15.3
N$20
  Top 0.508: C16.1 59.85,28 | 59.85,28 R18.1 | R19.2 59.85,25.8 59.85,28
N$21
  Top 0.508: R19.1 60.35,24 58.65,24 C17.1
N$22
  Top 0.508: R21.2 66.21,34 T1.3
N$23
  Top 0.508: R21.1 60.15,34.8 R22.2 61.85,37.15 61.5,37.5 59,37.5 58.5,38 58.5,38.5 57.65,39.35 C19.1
N$24
  Top 0.508: R22.1 58.5,34.85 58.5,34 58,33.5 57.15,33.5 C18.1
N$25
  Bottom 0.508: TUBE1.1 60.23,41.5 68.5,41.5 70,40 70,29.5 68.5,28 T2.2
N$26
  Top 0.508: TUBE2.1 70,42.73 70,39.08 67.42,36.5 T1.2
N$27
  Top 0.508: R20.2 66.21,30.5 T2.1
N$28
  Top 0.152: C20.1 43.85,34 39,34 38.25,34.75 U5.10
N$29
  Top 0.152: C21.1 38.75,40.6 U5.20
N$30
  Top 0.254: R26.1 28.35,30.2 CHG1.A
N$31  (via drill 0.35)
  Top 0.152: C22.1 43.3,37.45 43.3,37.37 41.43,35.5 v41,35.5 | v37,34.28 37.25,34.53 U5.8
  Bottom 0.152: v41,35.5 39.78,34.28 v37,34.28
OPTIONAL_BUTTON  (via drill 0.35)
  Top 0.152: 29.41,12.5 30.25,12.5 IC2.IO13 | v33,5 41.15,5 SW1.B'
  Top 0.508: SW1.B' SW1.B 43.85,2 R17.1 | v28.5,12.5 29.41,12.5 29.49,12.42 29.49,12.5
  Bottom 0.508: v33,5 28.5,9.5 v28.5,12.5
RESET  (via drill 0.35)
  Top 0.2: SW2.B' 32,8.09 v32,22 | v32,24.5 31.92,24.42 IC2.RST
  Top 0.406: Q1.3 28.64,28.36 30.45,26.55 IC2.RST | SW2.B' SW2.B
  Top 0.508: R3.1 23.35,31.65 25.17,29.83 Q1.3
  Bottom 0.2: v32,22 v32,24.5
RTS  (via drill 0.35)
  Top 0.406: R5.1 21.99,27.5 22.98,27.5 | 22.98,27.5 Q1.2 | U$7.14 16.59,19.41 v16.5,19.5 | v23,28.38 23,27.52 22.98,27.5
  Bottom 0.406: v16.5,19.5 16.5,22.5 22.38,28.38 v23,28.38
RXD
  Top 0.406: IC2.RXD/IO3 47.88,22.42 R11.2
SCL  (via drill 0.35)
  Top 0.152: R24.1 37.25,40.6 U5.23 37.25,37.7 v37.75,37.7 | v34.5,35 35.87,33.63 46.37,33.63 50,30 50,21.11 v50.11,21 | v47.5,20.5 45.5,20.5 IC2.IO5
  Bottom 0.152: v34.5,35 35.05,35 v37.75,37.7 37.5,37.5 37.5,48.58 SV1.6 | v50.11,21 49.61,20.5 v47.5,20.5
SDA  (via drill 0.35)
  Top 0.152: U5.24 35.5,39.47 | 35.5,39.47 34.97,39.47 34,38.5 32.15,38.5 R25.1 33.5,37.15 33.5,34.5 34.67,33.33 46.14,33.33 47.47,32 47.5,32 49.5,30 49.5,19.5 48.5,18.5 | 48.5,18.5 48.42,18.42 46.33,18.42 46.33,18 | 35.5,39.47 v35.5,40.5 | 48.5,18.5 45.5,18.5 IC2.IO4
  Bottom 0.152: SV1.5 35.5,48.04 v35.5,40.5
SPEAKER  (via drill 0.35)
  Top 0.152: 29.41,14.5 30.25,14.5 IC2.IO12
  Top 0.508: v53.5,9 52.5,8 v51.5,8 | v27.5,14.5 29.41,14.5 29.49,14.42
  Bottom 0.508: SPEAKER.1 44,37.5 53.5,28 v53.5,9 | v27.5,14.5 27.71,14.28 27.71,9.17 32.67,4.21 33.33,4.21 37.11,8 v51.5,8
TXD  (via drill 0.35)
  Top 0.406: U$7.3 10.06,19.41 v9.98,19.48 | v20,15.09 20.09,15 v23,15 | v41.5,18.5 41.5,22 43.92,24.42 IC2.TXD/IO1
  Bottom 0.406: v9.98,19.48 14.2,15.27 20,15.27 v20,15.09 | v23,15 24,15 27.5,18.5 v41.5,18.5
USB_RX  (via drill 0.35)
  Top 0.406: R11.1 43.45,21.45 v43,21 | v23,16 v20,16 | v10,20.5 12.63,20.5 U$7.2
  Bottom 0.406: v43,21 41.5,19.5 27,19.5 23.5,16 v23,16 | v20,16 14.5,16 v10,20.5
VBAT
  Top 0.152: 26,49.5 SV1.2
  Top 0.406: 7.83,38.17 9.45,39.78 SJ1.2 13,39.78 14.72,39.78 15.5,39 C3.1 | X1.2 7.83,45.17 7.83,38.17 | D4.A 8.5,31.26 8.5,35 7.83,35.66 7.83,38.17
  Top 0.508: SV1.2 16.7,39.78 13,39.78
VBUS  (via drill 0.35)
  Top 0.152: v8,24 7.5,24.5 7.5,26 D4.C
  Top 0.406: 15,25 15.39,25.39 CHG.A | X2.VBUS 6.3,17.8 7.06,18.56 | U2.1 2.37,30.63 1.5,29.77 1.5,27.5 2.34,26.66 R7.2 5,26.66 C6.1
  Top 0.508: U3.4 10.62,29.62 v9.5,28.5 | 15,25 14,24 v8,24 8,19.5 7.06,18.56 | D4.C 5.54,26.12 5,26.66 | v1.5,32 2.37,31.13 2.37,30.63 | X3.1 16.77,49.5 SV1.1
  Bottom 0.508: v9.5,28.5 8,27 v8,24 | X3.1 1.27,34 1.27,32.23 v1.5,32

### Text on the board
tPlace: + | + | + | 140V | 140V | Lipo 1S | + | + | VBUS | VBAT | 3.3V | 140V | SDA | SCL | GND | Power IN | Tube 1 | Tube 2 | Disable Battery | IN 9 Nixie Tubes | 140V INPUT | Ext. Supply | <--- Cut Here | ON | MJE340 | Onboard Supply | Gyro Powerd | Gyro | ON | MJE340 | Charge | HIGH VOLTAGE | CH340G | 3.3V | Hybride Nixie Clock | Jacco Veldscholten | GND | SIG | 3.3V | Reset | Mode
bPlace: This thing has more power than Moscow Electric Company | GitHub Software | HIGH VOLTAGE | 140V + | Jacco Veldscholten | 2020 | Hybride Nixie Clock